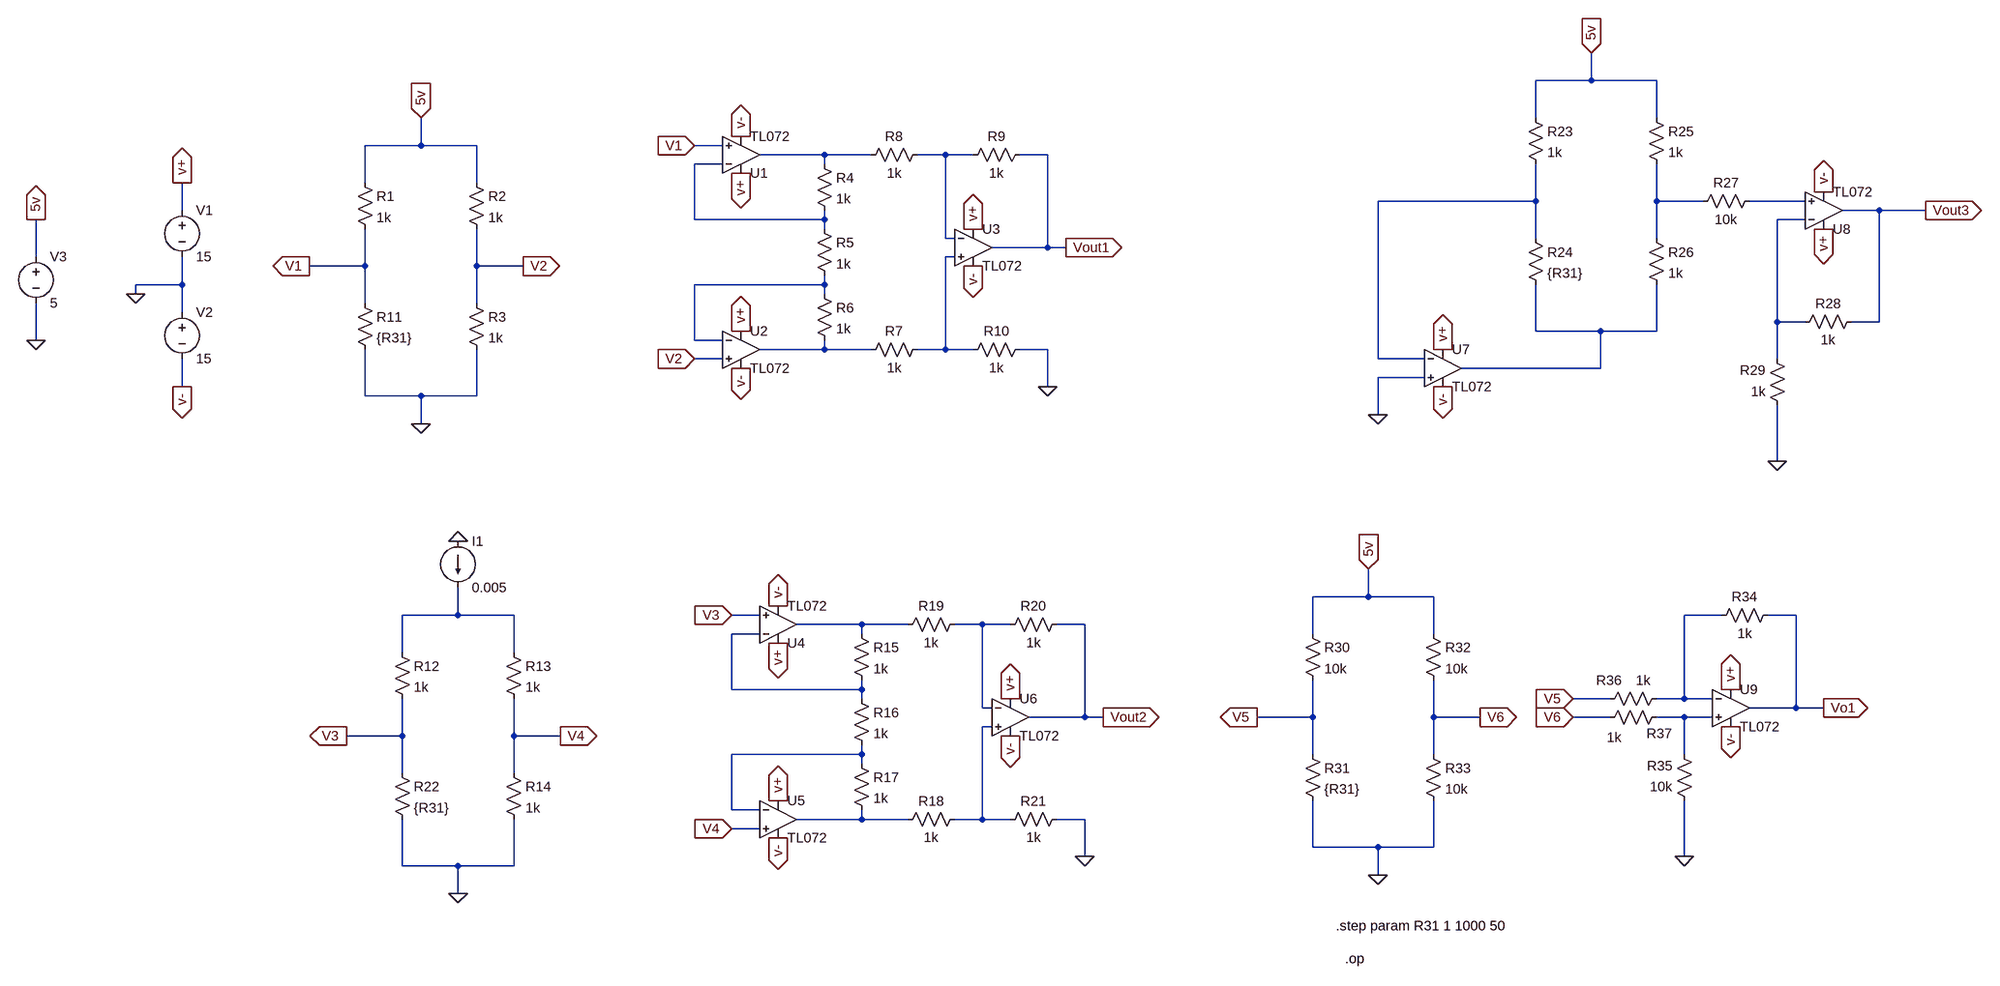
[diagram p0: schematic Wheatstone 2.asc]
Wheatstone 2.asc, the LTspice schematic file:
Version 4
SHEET 1 3008 1860
WIRE 2304 -592 2304 -640
WIRE 2304 -592 2208 -592
WIRE 2416 -592 2304 -592
WIRE 2208 -528 2208 -592
WIRE 2416 -528 2416 -592
WIRE 16 -480 16 -528
WIRE 16 -480 -80 -480
WIRE 112 -480 16 -480
WIRE 672 -480 624 -480
WIRE 848 -464 736 -464
WIRE 928 -464 848 -464
WIRE 1056 -464 1008 -464
WIRE 1104 -464 1056 -464
WIRE 1232 -464 1184 -464
WIRE 672 -448 624 -448
WIRE 848 -448 848 -464
WIRE -80 -416 -80 -480
WIRE 112 -416 112 -480
WIRE 2208 -384 2208 -448
WIRE 2208 -384 1936 -384
WIRE 2416 -384 2416 -448
WIRE 2496 -384 2416 -384
WIRE 2672 -384 2576 -384
WIRE -592 -368 -592 -416
WIRE 2800 -368 2736 -368
WIRE 2880 -368 2800 -368
WIRE 624 -352 624 -448
WIRE 848 -352 848 -368
WIRE 848 -352 624 -352
WIRE 2672 -352 2624 -352
WIRE 848 -336 848 -352
WIRE 1056 -320 1056 -464
WIRE 1072 -320 1056 -320
WIRE 2208 -320 2208 -384
WIRE 2416 -320 2416 -384
WIRE 1232 -304 1232 -464
WIRE 1232 -304 1136 -304
WIRE 1264 -304 1232 -304
WIRE -912 -288 -912 -352
WIRE 1072 -288 1056 -288
WIRE -80 -272 -80 -336
WIRE -80 -272 -176 -272
WIRE 112 -272 112 -336
WIRE 192 -272 112 -272
WIRE -592 -240 -592 -288
WIRE -592 -240 -672 -240
WIRE 848 -240 848 -256
WIRE 848 -240 624 -240
WIRE -672 -224 -672 -240
WIRE 848 -224 848 -240
WIRE -80 -208 -80 -272
WIRE 112 -208 112 -272
WIRE -592 -192 -592 -240
WIRE 2624 -176 2624 -352
WIRE 2672 -176 2624 -176
WIRE 2800 -176 2800 -368
WIRE 2800 -176 2752 -176
WIRE 2208 -160 2208 -240
WIRE 2320 -160 2208 -160
WIRE 2416 -160 2416 -240
WIRE 2416 -160 2320 -160
WIRE -912 -144 -912 -208
WIRE 624 -144 624 -240
WIRE 672 -144 624 -144
WIRE 848 -128 848 -144
WIRE 848 -128 736 -128
WIRE 928 -128 848 -128
WIRE 1056 -128 1056 -288
WIRE 1056 -128 1008 -128
WIRE 1104 -128 1056 -128
WIRE 1232 -128 1184 -128
WIRE 672 -112 624 -112
WIRE 1936 -112 1936 -384
WIRE 2016 -112 1936 -112
WIRE 2624 -112 2624 -176
WIRE 2320 -96 2320 -160
WIRE 2320 -96 2080 -96
WIRE 2016 -80 1936 -80
WIRE -592 -64 -592 -112
WIRE 1232 -64 1232 -128
WIRE -80 -48 -80 -128
WIRE 16 -48 -80 -48
WIRE 112 -48 112 -128
WIRE 112 -48 16 -48
WIRE 1936 -16 1936 -80
WIRE 16 0 16 -48
WIRE 2624 64 2624 -32
WIRE 1920 480 1920 432
WIRE 1920 480 1824 480
WIRE 2032 480 1920 480
WIRE 80 512 80 464
WIRE 80 512 -16 512
WIRE 176 512 80 512
WIRE 736 512 688 512
WIRE 2528 512 2464 512
WIRE 2656 512 2608 512
WIRE 912 528 800 528
WIRE 992 528 912 528
WIRE 1120 528 1072 528
WIRE 1168 528 1120 528
WIRE 1296 528 1248 528
WIRE 736 544 688 544
WIRE 912 544 912 528
WIRE 1824 544 1824 480
WIRE 2032 544 2032 480
WIRE -16 576 -16 512
WIRE 176 576 176 512
WIRE 688 640 688 544
WIRE 912 640 912 624
WIRE 912 640 688 640
WIRE 912 656 912 640
WIRE 2336 656 2272 656
WIRE 2464 656 2464 512
WIRE 2464 656 2416 656
WIRE 2512 656 2464 656
WIRE 1120 672 1120 528
WIRE 1136 672 1120 672
WIRE 2656 672 2656 512
WIRE 2656 672 2576 672
WIRE 2704 672 2656 672
WIRE 1296 688 1296 528
WIRE 1296 688 1200 688
WIRE 1328 688 1296 688
WIRE 1824 688 1824 624
WIRE 1824 688 1728 688
WIRE 2032 688 2032 624
WIRE 2112 688 2032 688
WIRE 2336 688 2272 688
WIRE 2464 688 2416 688
WIRE 2512 688 2464 688
WIRE 1136 704 1120 704
WIRE -16 720 -16 656
WIRE -16 720 -112 720
WIRE 176 720 176 656
WIRE 256 720 176 720
WIRE 912 752 912 736
WIRE 912 752 688 752
WIRE 1824 752 1824 688
WIRE 2032 752 2032 688
WIRE 2464 752 2464 688
WIRE 912 768 912 752
WIRE -16 784 -16 720
WIRE 176 784 176 720
WIRE 688 848 688 752
WIRE 736 848 688 848
WIRE 912 864 912 848
WIRE 912 864 800 864
WIRE 992 864 912 864
WIRE 1120 864 1120 704
WIRE 1120 864 1072 864
WIRE 1168 864 1120 864
WIRE 1296 864 1248 864
WIRE 736 880 688 880
WIRE 1824 912 1824 832
WIRE 1936 912 1824 912
WIRE 2032 912 2032 832
WIRE 2032 912 1936 912
WIRE 1296 928 1296 864
WIRE 2464 928 2464 832
WIRE -16 944 -16 864
WIRE 80 944 -16 944
WIRE 176 944 176 864
WIRE 176 944 80 944
WIRE 1936 960 1936 912
WIRE 80 992 80 944
FLAG 16 -528 5v
IOPIN 16 -528 In
FLAG 704 -432 v+
IOPIN 704 -432 Out
FLAG 704 -496 v-
IOPIN 704 -496 Out
FLAG 16 0 0
FLAG -176 -272 V1
IOPIN -176 -272 Out
FLAG 192 -272 V2
IOPIN 192 -272 Out
FLAG 704 -160 v+
IOPIN 704 -160 Out
FLAG 704 -96 v-
IOPIN 704 -96 Out
FLAG 1104 -336 v+
IOPIN 1104 -336 Out
FLAG 1104 -272 v-
IOPIN 1104 -272 Out
FLAG 624 -480 V1
IOPIN 624 -480 In
FLAG 624 -112 V2
IOPIN 624 -112 In
FLAG 1232 -64 0
FLAG 768 560 v+
IOPIN 768 560 Out
FLAG 768 496 v-
IOPIN 768 496 Out
FLAG 80 992 0
FLAG -112 720 V3
IOPIN -112 720 Out
FLAG 256 720 V4
IOPIN 256 720 Out
FLAG 768 832 v+
IOPIN 768 832 Out
FLAG 768 896 v-
IOPIN 768 896 Out
FLAG 1168 656 v+
IOPIN 1168 656 Out
FLAG 1168 720 v-
IOPIN 1168 720 Out
FLAG 688 512 V3
IOPIN 688 512 In
FLAG 688 880 V4
IOPIN 688 880 In
FLAG 1296 928 0
FLAG 80 384 0
FLAG 1264 -304 Vout1
IOPIN 1264 -304 Out
FLAG 1328 688 Vout2
IOPIN 1328 688 Out
FLAG -672 -224 0
FLAG -912 -144 0
FLAG -912 -352 5v
IOPIN -912 -352 Out
FLAG -592 -416 v+
IOPIN -592 -416 Out
FLAG -592 -64 v-
IOPIN -592 -64 Out
FLAG 2048 -128 v+
IOPIN 2048 -128 Out
FLAG 2048 -64 v-
IOPIN 2048 -64 Out
FLAG 1936 -16 0
FLAG 2304 -640 5v
IOPIN 2304 -640 In
FLAG 2704 -336 v+
IOPIN 2704 -336 Out
FLAG 2704 -400 v-
IOPIN 2704 -400 Out
FLAG 2624 64 0
FLAG 2880 -368 Vout3
IOPIN 2880 -368 Out
FLAG 1920 432 5v
IOPIN 1920 432 In
FLAG 1936 960 0
FLAG 1728 688 V5
IOPIN 1728 688 Out
FLAG 2112 688 V6
IOPIN 2112 688 Out
FLAG 2544 640 v+
IOPIN 2544 640 Out
FLAG 2544 704 v-
IOPIN 2544 704 Out
FLAG 2464 928 0
FLAG 2272 656 V5
IOPIN 2272 656 In
FLAG 2272 688 V6
IOPIN 2272 688 In
FLAG 2704 672 Vo1
IOPIN 2704 672 Out
SYMBOL res -96 -432 R0
SYMATTR InstName R1
SYMATTR Value 1k
SYMBOL res 96 -432 R0
SYMATTR InstName R2
SYMATTR Value 1k
SYMBOL res 96 -224 R0
SYMATTR InstName R3
SYMATTR Value 1k
SYMBOL AutoGenerated\\TL072 704 -464 M180
SYMATTR InstName U1
SYMBOL AutoGenerated\\TL072 704 -128 R0
SYMATTR InstName U2
SYMBOL AutoGenerated\\TL072 1104 -304 R0
SYMATTR InstName U3
SYMBOL res 832 -464 R0
SYMATTR InstName R4
SYMATTR Value 1k
SYMBOL res 832 -352 R0
SYMATTR InstName R5
SYMATTR Value 1k
SYMBOL res 832 -240 R0
SYMATTR InstName R6
SYMATTR Value 1k
SYMBOL res 1024 -144 R90
WINDOW 0 0 56 VBottom 2
WINDOW 3 32 56 VTop 2
SYMATTR InstName R7
SYMATTR Value 1k
SYMBOL res 1024 -480 R90
WINDOW 0 0 56 VBottom 2
WINDOW 3 32 56 VTop 2
SYMATTR InstName R8
SYMATTR Value 1k
SYMBOL res 1200 -480 R90
WINDOW 0 0 56 VBottom 2
WINDOW 3 32 56 VTop 2
SYMATTR InstName R9
SYMATTR Value 1k
SYMBOL res 1200 -144 R90
WINDOW 0 0 56 VBottom 2
WINDOW 3 32 56 VTop 2
SYMATTR InstName R10
SYMATTR Value 1k
SYMBOL res -96 -224 R0
SYMATTR InstName R11
SYMATTR Value {R31}
SYMBOL res -32 560 R0
SYMATTR InstName R12
SYMATTR Value 1k
SYMBOL res 160 560 R0
SYMATTR InstName R13
SYMATTR Value 1k
SYMBOL res 160 768 R0
SYMATTR InstName R14
SYMATTR Value 1k
SYMBOL AutoGenerated\\TL072 768 528 M180
SYMATTR InstName U4
SYMBOL AutoGenerated\\TL072 768 864 R0
SYMATTR InstName U5
SYMBOL AutoGenerated\\TL072 1168 688 R0
SYMATTR InstName U6
SYMBOL res 896 528 R0
SYMATTR InstName R15
SYMATTR Value 1k
SYMBOL res 896 640 R0
SYMATTR InstName R16
SYMATTR Value 1k
SYMBOL res 896 752 R0
SYMATTR InstName R17
SYMATTR Value 1k
SYMBOL res 1088 848 R90
WINDOW 0 0 56 VBottom 2
WINDOW 3 32 56 VTop 2
SYMATTR InstName R18
SYMATTR Value 1k
SYMBOL res 1088 512 R90
WINDOW 0 0 56 VBottom 2
WINDOW 3 32 56 VTop 2
SYMATTR InstName R19
SYMATTR Value 1k
SYMBOL res 1264 512 R90
WINDOW 0 0 56 VBottom 2
WINDOW 3 32 56 VTop 2
SYMATTR InstName R20
SYMATTR Value 1k
SYMBOL res 1264 848 R90
WINDOW 0 0 56 VBottom 2
WINDOW 3 32 56 VTop 2
SYMATTR InstName R21
SYMATTR Value 1k
SYMBOL res -32 768 R0
SYMATTR InstName R22
SYMATTR Value {R31}
SYMBOL current 80 384 R0
WINDOW 123 0 0 Left 0
WINDOW 39 0 0 Left 0
SYMATTR InstName I1
SYMATTR Value 0.005
SYMBOL voltage -592 -384 R0
WINDOW 123 0 0 Left 0
WINDOW 39 0 0 Left 0
SYMATTR InstName V1
SYMATTR Value 15
SYMBOL voltage -592 -208 R0
WINDOW 123 0 0 Left 0
WINDOW 39 0 0 Left 0
SYMATTR InstName V2
SYMATTR Value 15
SYMBOL voltage -912 -304 R0
WINDOW 123 0 0 Left 0
WINDOW 39 0 0 Left 0
SYMATTR InstName V3
SYMATTR Value 5
SYMBOL res 2192 -544 R0
SYMATTR InstName R23
SYMATTR Value 1k
SYMBOL res 2192 -336 R0
SYMATTR InstName R24
SYMATTR Value {R31}
SYMBOL res 2400 -544 R0
SYMATTR InstName R25
SYMATTR Value 1k
SYMBOL res 2400 -336 R0
SYMATTR InstName R26
SYMATTR Value 1k
SYMBOL AutoGenerated\\TL072 2048 -96 R0
SYMATTR InstName U7
SYMBOL AutoGenerated\\TL072 2704 -368 M180
SYMATTR InstName U8
SYMBOL res 2592 -400 R90
WINDOW 0 0 56 VBottom 2
WINDOW 3 32 56 VTop 2
SYMATTR InstName R27
SYMATTR Value 10k
SYMBOL res 2768 -192 R90
WINDOW 0 0 56 VBottom 2
WINDOW 3 32 56 VTop 2
SYMATTR InstName R28
SYMATTR Value 1k
SYMBOL res 2640 -16 R180
WINDOW 0 36 76 Left 2
WINDOW 3 36 40 Left 2
SYMATTR InstName R29
SYMATTR Value 1k
SYMBOL res 1808 528 R0
SYMATTR InstName R30
SYMATTR Value 10k
SYMBOL res 1808 736 R0
SYMATTR InstName R31
SYMATTR Value {R31}
SYMBOL res 2016 528 R0
SYMATTR InstName R32
SYMATTR Value 10k
SYMBOL res 2016 736 R0
SYMATTR InstName R33
SYMATTR Value 10k
SYMBOL AutoGenerated\\TL072 2544 672 R0
SYMATTR InstName U9
SYMBOL res 2624 496 R90
WINDOW 0 0 56 VBottom 2
WINDOW 3 32 56 VTop 2
SYMATTR InstName R34
SYMATTR Value 1k
SYMBOL res 2480 848 R180
WINDOW 0 36 76 Left 2
WINDOW 3 36 40 Left 2
SYMATTR InstName R35
SYMATTR Value 10k
SYMBOL res 2432 640 R90
WINDOW 0 0 98 VBottom 2
WINDOW 3 -31 39 VTop 2
SYMATTR InstName R36
SYMATTR Value 1k
SYMBOL res 2432 672 R90
WINDOW 0 60 11 VBottom 2
WINDOW 3 35 89 VTop 2
SYMATTR InstName R37
SYMATTR Value 1k
TEXT 1864 1048 Left 2 !.step param R31 1 1000 50
TEXT 1880 1104 Left 2 !.op

The netlist it stands for:
* Wheatstone 2.asc
R1 5v V1 1k
R2 5v V2 1k
R3 V2 0 1k
* U1: TL072 (symbol AutoGenerated\TL072 not available, pins judged from their places): In+=V1 In-=N003 V+=v+ V-=v- OUT=N001
* U2: TL072 (symbol AutoGenerated\TL072 not available, pins judged from their places): In+=V2 In-=N009 V+=v+ V-=v- OUT=N011
* U3: TL072 (symbol AutoGenerated\TL072 not available, pins judged from their places): In+=N008 In-=N002 V+=v+ V-=v- OUT=Vout1
R4 N001 N003 1k
R5 N003 N009 1k
R6 N009 N011 1k
R7 N008 N011 1k
R8 N002 N001 1k
R9 Vout1 N002 1k
R10 0 N008 1k
R11 V1 0 {R31}
R12 N012 V3 1k
R13 N012 V4 1k
R14 V4 0 1k
* U4: TL072 (symbol AutoGenerated\TL072 not available, pins judged from their places): In+=V3 In-=N016 V+=v+ V-=v- OUT=N014
* U5: TL072 (symbol AutoGenerated\TL072 not available, pins judged from their places): In+=V4 In-=N019 V+=v+ V-=v- OUT=N020
* U6: TL072 (symbol AutoGenerated\TL072 not available, pins judged from their places): In+=N018 In-=N015 V+=v+ V-=v- OUT=Vout2
R15 N014 N016 1k
R16 N016 N019 1k
R17 N019 N020 1k
R18 N018 N020 1k
R19 N015 N014 1k
R20 Vout2 N015 1k
R21 0 N018 1k
R22 V3 0 {R31}
I1 0 N012 0.005
V1 v+ 0 15
V2 0 v- 15
V3 5v 0 5
R23 5v N004 1k
R24 N004 N010 {R31}
R25 5v N005 1k
R26 N005 N010 1k
* U7: TL072 (symbol AutoGenerated\TL072 not available, pins judged from their places): In+=0 In-=N004 V+=v+ V-=v- OUT=N010
* U8: TL072 (symbol AutoGenerated\TL072 not available, pins judged from their places): In+=N006 In-=N007 V+=v+ V-=v- OUT=Vout3
R27 N006 N005 10k
R28 Vout3 N007 1k
R29 0 N007 1k
R30 5v V5 10k
R31 V5 0 {R31}
R32 5v V6 10k
R33 V6 0 10k
* U9: TL072 (symbol AutoGenerated\TL072 not available, pins judged from their places): In+=N017 In-=N013 V+=v+ V-=v- OUT=Vo1
R34 Vo1 N013 1k
R35 0 N017 10k
R36 N013 V5 1k
R37 N017 V6 1k
.step param R31 1 1000 50
.op
.backanno
.end